# EAGLE design siren (EAGLE 9.3.0)
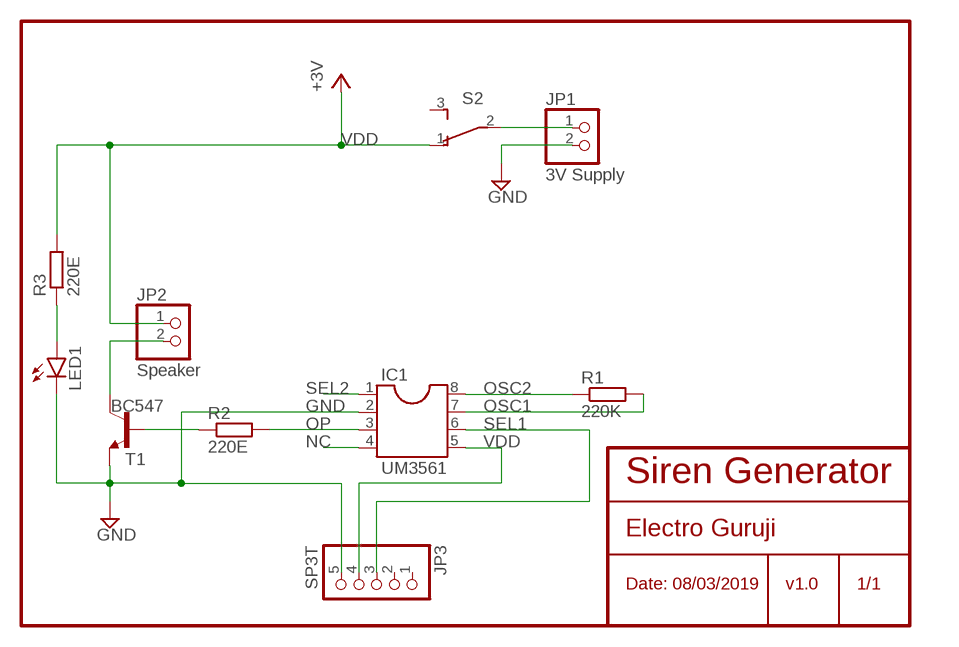
[diagram p0: schematic, sheet 1]

## Parts
IC1  UM3561  DIL8S  [SOCKET-08]
JP1  3V Supply  PINHD-1X2  [1X02]
JP2  Speaker  PINHD-1X2  [1X02]
JP3  SP3T  PINHD-1X5  [1X05]
LED1  LED5MM  [LED5MM]
R1  220K  R-EU_0204/5  [0204/5]
R2  220E  R-EU_0204/5  [0204/5]
R3  220E  R-EU_0204/5  [0204/5]
S2  TL36YO  [TL3XYO]
T1  BC547  -NPN-TO92-EBC  [TO92-EBC]

## Nets
GND: IC1.2 JP1.2 JP3.5 LED1.K(C) T1.E
N$1: JP1.1 S2.2(P)
N$2: LED1.A R3.1
N$3: JP2.2 T1.C
N$4: R2.1 T1.B
NC: IC1.4
OP: IC1.3 R2.2
OSC1: IC1.7 R1.2
OSC2: IC1.8 R1.1
SEL1: IC1.6 JP3.3
SEL2: IC1.1
VDD: IC1.5 JP2.1 JP3.4 R3.2 S2.1(O) ; supply symbol labelled +3V
Unconnected: JP3.1 JP3.2 S2.3(S)

## Notes on the sheet
- Siren Generator
- Electro Guruji
- Date: 08/03/2019 | v1.0 | 1/1

## Library data of the parts
IC1 = ic-package:DIL8: Dual In Line / Socket
JP1 = pinhead:PINHD-1X2: PIN HEADER; SPICEPREFIX: B
JP2 = pinhead:PINHD-1X2: PIN HEADER
JP3 = pinhead:PINHD-1X5: PIN HEADER
LED1 = led:LED: LED OSRAM: - CHIPLED LG R971, LG N971, LY N971, LG Q971, LY Q971, LO R971, LY R971 LH N974, LH R974 LS Q976, LO Q976, LY Q976 LO Q996 - Hyper CHIPLED LW Q18S LB Q993, LB Q99A, LB R99A - SideLED LS A670, LO A670, LY A670, LG A670, LP A670 LB A673, LV A673, LT A673, LW A673 LH A674 LY A675 LS A676, LA A676, LO A676, LY A676, LW A676 LS A679, LY A679, LG A679 - Hyper Micro SIDELED® LS Y876, LA Y876, LO Y876, LY Y876 LT Y87S - SmartLED LW L88C, LW L88S LB L89C, LB L89S, LG L890 LS L89K, LO L89K, LY L89K LS L896, LA L896, LO L896, LY L896 - TOPLED LS T670, LO T670, LY T670, LG T670, LP T670 LSG T670, LSP T670, LSY T670, LOP T670, LYG T670 LG T671, LOG T671, LSG T671 LB T673, LV T673, LT T673, LW T673 LH T674 LS T676, LA T676, LO T676, LY T676, LB T676, LH T676, LSB T676, LW T676 LB T67C, LV T67C, LT T67C, LS T67K, LO T67K, LY T67K, LW E67C LS E67B, LA E67B, LO E67B, LY E67B, LB E67C, LV E67C, LT E67C LW T67C LS T679, LY T679, LG T679 LS T770, LO T770, LY T770, LG T770, LP T770 LB T773, LV T773, LT T773, LW T773 LH T774 LS E675, LA E675, LY E675, LS T675 LS T776, LA T776, LO T776, LY T776, LB T776 LHGB T686 LT T68C, LB T68C - Hyper Mini TOPLED® LB M676 - Mini TOPLED Santana® LG M470 LS M47K, LO M47K, LY M47K Source: http://www.osram.convergy.de LUXEON: - LUMILED® LXK2-PW12-R00, LXK2-PW12-S00, LXK2-PW14-U00, LXK2-PW14-V00 LXK2-PM12-R00, LXK2-PM12-S00, LXK2-PM14-U00 LXK2-PE12-Q00, LXK2-PE12-R00, LXK2-PE12-S00, LXK2-PE14-T00, LXK2-PE14-U00 LXK2-PB12-K00, LXK2-PB12-L00, LXK2-PB12-M00, LXK2-PB14-N00, LXK2-PB14-P00, LXK2-PB14-Q00 LXK2-PR12-L00, LXK2-PR12-M00, LXK2-PR14-Q00, LXK2-PR14-R00 LXK2-PD12-Q00, LXK2-PD12-R00, LXK2-PD12-S00 LXK2-PH12-R00, LXK2-PH12-S00 LXK2-PL12-P00, LXK2-PL12-Q00, LXK2-PL12-R00 Source: www.luxeon.com KINGBRIGHT: KA-3528ASYC Source: www.kingbright.com
R1-R3 = resistor:R-EU_: RESISTOR, European symbol
S2 = switch:TL36YO: TINY SWITCH ON - ON Source: http://www2.produktinfo.conrad.com/datenblaetter/700000-724999/705152-da-01-de-Subminiaturschalter_TL_36YO.pdf
T1 = transistor:*-NPN-: NPN Transistror BF959 corrected 2008.03.06

## Board
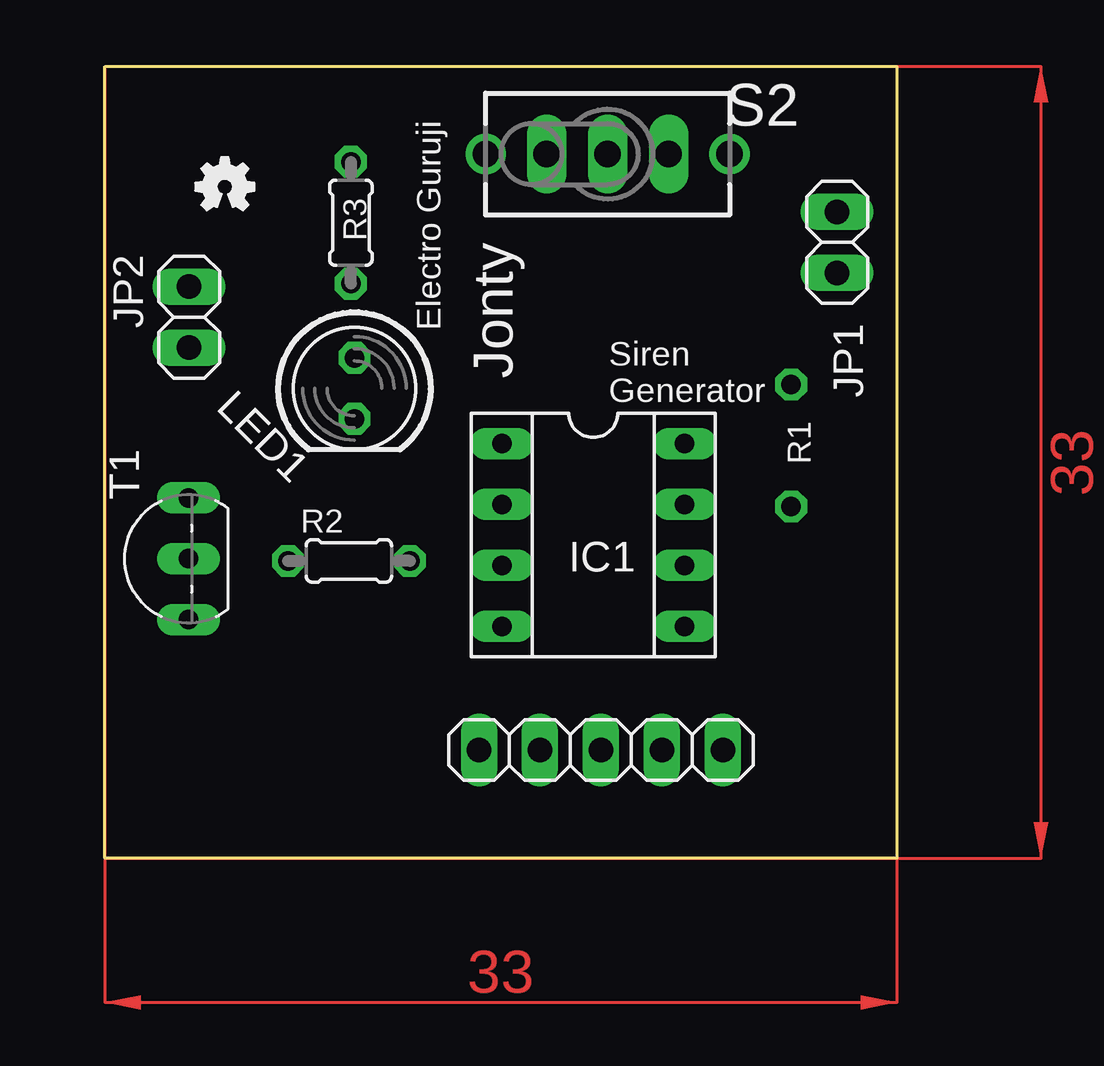
[diagram p1: board, top side]
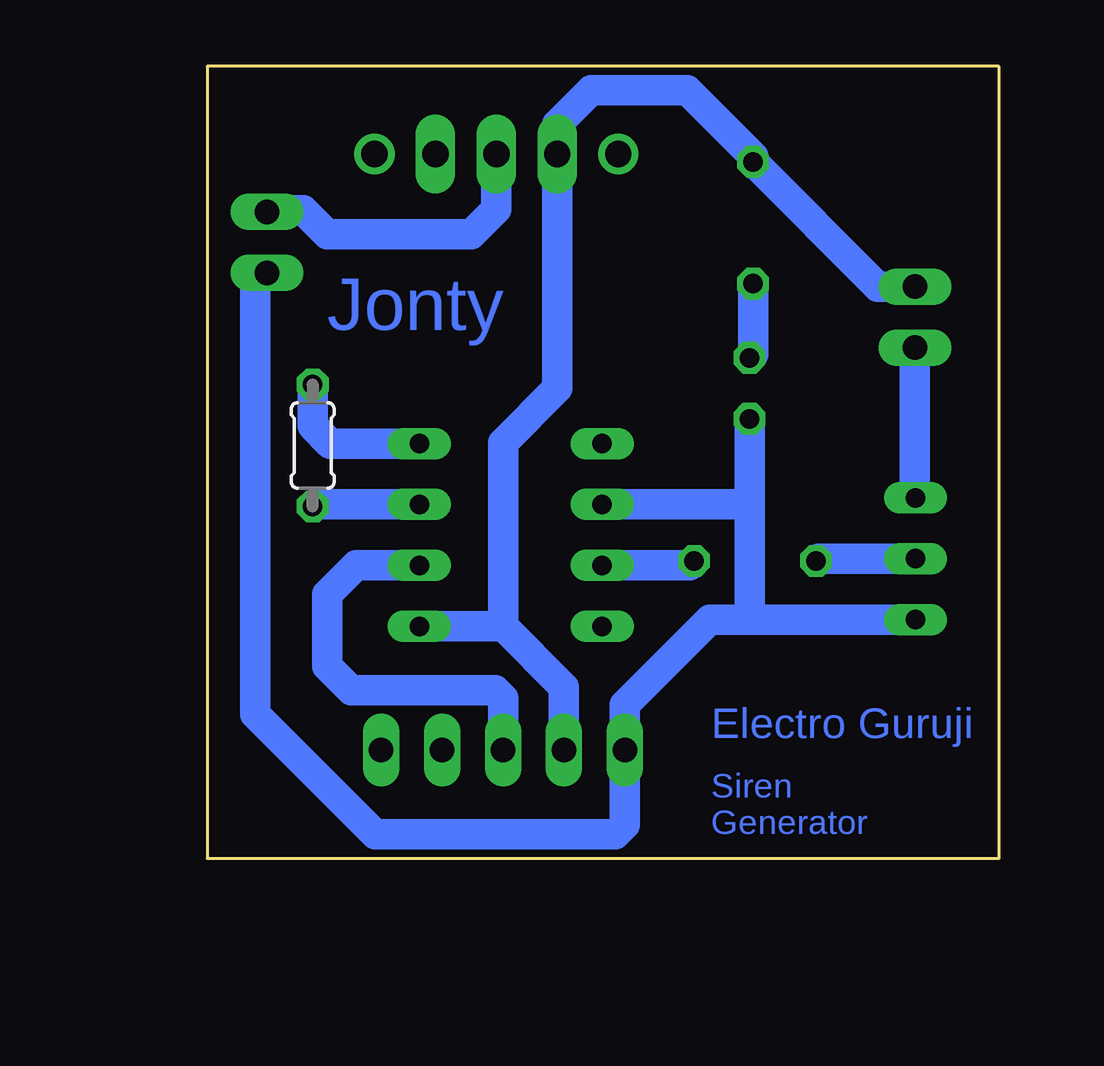
[diagram p2: board, bottom side, seen from below]

Size 33 x 33 mm. Coordinates in mm from the lower left corner, seen from the top.
Outline: 0,33 33,33 33,0 0,0 0,33
Copper layers (1*16): Top 0.035mm / dielectric 1.5mm / Bottom 0.035mm
Design rules "default": minimum track width 6mil, minimum drill 0.35mm, track to track 6mil, track to pad 6mil, pad to pad 6mil, via to via 6mil, smd to smd 6mil, copper to edge 40mil, drill to drill 6mil, minimum pad ring 10mil, minimum via ring 8mil, stop-mask expansion 4mil, vias tented up to drill 0mil, thermal gap 10mil

### Footprints (pad centres in the part's own frame; a part is rotated, then mirrored left to right if it is on the bottom)
SOCKET-08 = drill 0.813 long: 1 -3.81,-3.81; 2 -1.27,-3.81; 3 1.27,-3.81; 4 3.81,-3.81; 5 3.81,3.81; 6 1.27,3.81; 7 -1.27,3.81; 8 -3.81,3.81
1X02 = drill 1.016 long: 1 -1.27,0; 2 1.27,0
1X05 = drill 1.016 long: 1 -5.08,0; 2 -2.54,0; 3 0,0; 4 2.54,0; 5 5.08,0
LED5MM = drill 0.813 octagon: A -1.27,0; K 1.27,0
0204/5 = drill 0.813 octagon: 1 -2.54,0; 2 2.54,0
TL3XYO = drill 1.1 pad 1.422 long: 1 -2.54,0; 2 0,0; 3 2.54,0 | drill 1.1 pad 1.676: M1 -5.08,0; M2 5.08,0
TO92-EBC = drill 0.813 long: B 0,-1.27; C 2.54,-1.27; E -2.54,-1.27

### Placement (x,y rotation side)
IC1  20.35,13.48 270 top
JP1  30.51,25.67 270 top
JP2  3.51,22.56 270 top
JP3  20.67,4.52 180 top
LED1  10.4,19.59 270 top
R1  28.6,17.21 270 bottom
R2  10.17,12.4 0 top
R3  10.25,26.49 90 top
S2  20.95,29.35 0 top
T1  2.22,12.49 90 top
U$1  [OSHW-LOGO-MINI]  5,28 0 top

### Tracks (layer width: path | path; a pad name or v marks a point on that pad's centre or on a via)
GND
  Bottom 1.27: LED1.K 10.4,15 | 10.4,15 10.4,10 10.35,9.95 | T1.E 10.35,9.95 | IC1.2 10.65,14.75 10.4,15 | JP1.2 31,23.91 31,6 26,1 16,1 15.59,1.41 JP3.5 15.59,6.41 12.05,9.95 10.35,9.95
N$1
  Bottom 1.27: S2.2 20.95,27.05 22,26 28,26 29,27 30.45,27 JP1.1
N$2
  Bottom 1.27: R3.1 10.25,21.01 LED1.A
N$3
  Bottom 1.27: JP2.2 3.51,15.05 T1.C
N$4
  Bottom 1.27: T1.B 7.54,12.49 R2.1
OP
  Bottom 1.27: IC1.3 12.9,12.21 R2.2
OSC1
  Bottom 1.27: 25.32,14.75 IC1.7 28.52,14.75 R1.2
OSC2
  Bottom 1.27: IC1.8 27.86,17.29 28.6,18.03 R1.1
SEL1
  Bottom 1.27: JP3.3 20.67,6.67 21,7 27,7 28,8 28,11 26.79,12.21 IC1.6
VDD
  Bottom 1.27: JP2.1 5.05,23.83 R3.2 10.25,29.25 13,32 17,32 18.41,30.59 S2.1 18.41,19.59 20.67,17.33 20.67,9.67 | JP3.4 18.13,7.13 20.67,9.67 | IC1.5 20.67,9.67
(copper drawn outside any net)
  shapes: Top area x2

### Text on the board
Bottom: Jonty | Electro Guruji | Siren / Generator
tNames: Electro Guruji | Jonty | Siren / Generator